# Altium schematic sheet fuente1.SchDoc
size A4
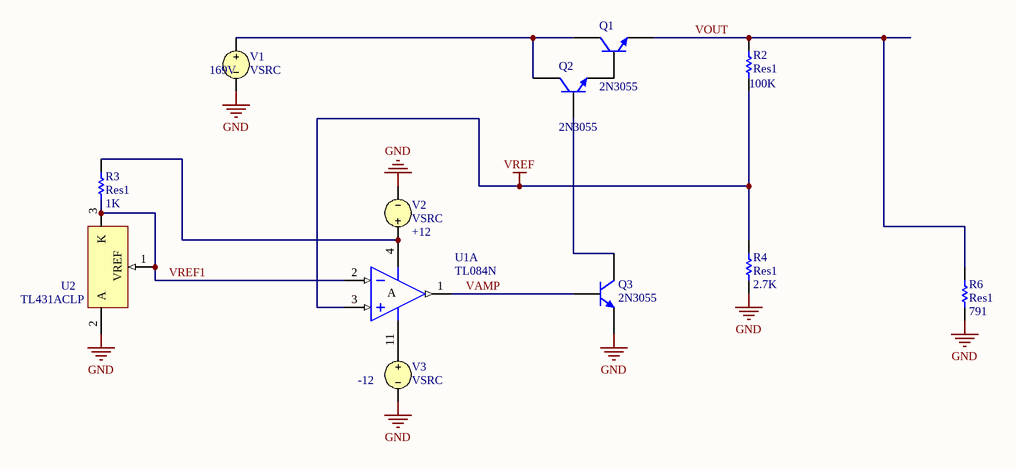
[diagram p0: fuente1.SchDoc]

## Parts
Q1  2N3055  [TO-3]
Q2  2N3055  [TO-3]
Q3  2N3055  [TO-3]
R2  Res1  value 100K  [AXIAL-0.3]
R3  Res1  value 1K  [AXIAL-0.3]
R4  Res1  value 2.7K  [AXIAL-0.3]
R6  Res1  value 791  [AXIAL-0.3]
U1  TL084N  [N014]  (part A of 4)
U2  TL431ACLP  [LP03]
V1  VSRC  value 169V
V2  VSRC  value +12
V3  VSRC  value -12

## Nets
GND: Q3.2(E) R4.1 R6.1 U2.2(A) V1.2 V2.2 V3.2
VREF: R2.1 R4.2 U1.3(IN+)
VAMP: Q3.1(B) U1.1(OUT)
VOUT: Q1.2(E) R2.2 R6.2
VREF1: R3.1 U1.2(IN-) U2.1(VREF) U2.3(K)
NetQ1_1: Q1.1(B) Q2.2(E)
NetQ1_3: Q1.3(C) Q2.3(C) V1.1
NetQ2_1: Q2.1(B) Q3.3(C)
NetR3_2: R3.2 U1.4(V+) V2.1
NetU1_11: U1.11(V-) V3.1

## Notes on the sheet
- (in symbol TL084N, part A) A

## Library data of the parts
Q1-Q3 = 2N3055: Complementary Silicon Power Transistor; Note: The Tab is pin 3; Published: 8-Jun-2000; LatestRevisionDate: 11-Dec-2002; LatestRevisionNote: Sim Port Map correction; DatasheetVersion: Aug-1999; PackageReference: TO-3; Publisher: Altium Limited; PackageDescription: Oval Flange Mount with (2) Offset Leads; Pin Spacing 10.92 mm; Lead Dia. 1.15 mm (max); ComponentLink1Description: Manufacturer Link; ComponentLink1URL: http://www.st.com/; ComponentLink2Description: Datasheet; ComponentLink2URL: http://www.st.com/stonline/products/literature/ds/4079/2n3055.pdf
R2-R4 R6 = Res1: Resistor; Published: 8-Jun-2000; LatestRevisionDate: 17-Jul-2002; LatestRevisionNote: Re-released for DXP Platform.; PackageReference: AXIAL-0.3; Publisher: Altium Limited
U1 = TL084N: JFET-Input Operational Amplifier; Published: 16-Jan-2001; LatestRevisionDate: 04-Mar-2005; LatestRevisionNote: Stylized 3D Model Added.; DatasheetVersion: Feb-1999; PackageVersion: Oct-1995; PackageReference: N014; Publisher: Altium Limited; PackageDescription: DIP; 14 Leads; Row Spacing 7.62 mm; Pitch 2.54 mm; ComponentLink1Description: Manufacturer Link; ComponentLink1URL: http://www.ti.com/; ComponentLink2Description: Datasheet; ComponentLink2URL: http://www-s.ti.com/sc/ds/tl084.pdf
U2 = TL431ACLP: Adjustable Precision Shunt Regulator; Published: 15-Apr-2002; LatestRevisionDate: 06-Jun-2005; LatestRevisionNote: Sch pins 1 & 3 swapped; DatasheetVersion: Oct-2000; PackageVersion: Nov-2001; PackageReference: LP03; Publisher: Altium Limited; PackageDescription: TO, Flat Index; 3 In-Line, Axial Leads; Body Dia. 4.8mm; Leads 0.56 x 0.41 mm (max); Code_JEDEC: TO-226-AA; ComponentLink1Description: Manufacturer Link; ComponentLink1URL: http://www.ti.com/; ComponentLink2Description: Datasheet; ComponentLink2URL: http://www-s.ti.com/sc/ds/tl431a.pdf
V1-V3 = VSRC: Voltage Source; Note: PCB Footprint - Not required; Published: 8-Jun-2000; LatestRevisionDate: 17-Jul-2002; LatestRevisionNote: Re-released for DXP Platform.; PackageReference: Not Applicable; Publisher: Altium Limited